# Altium schematic sheet SHC_BMS.SchDoc
size A4
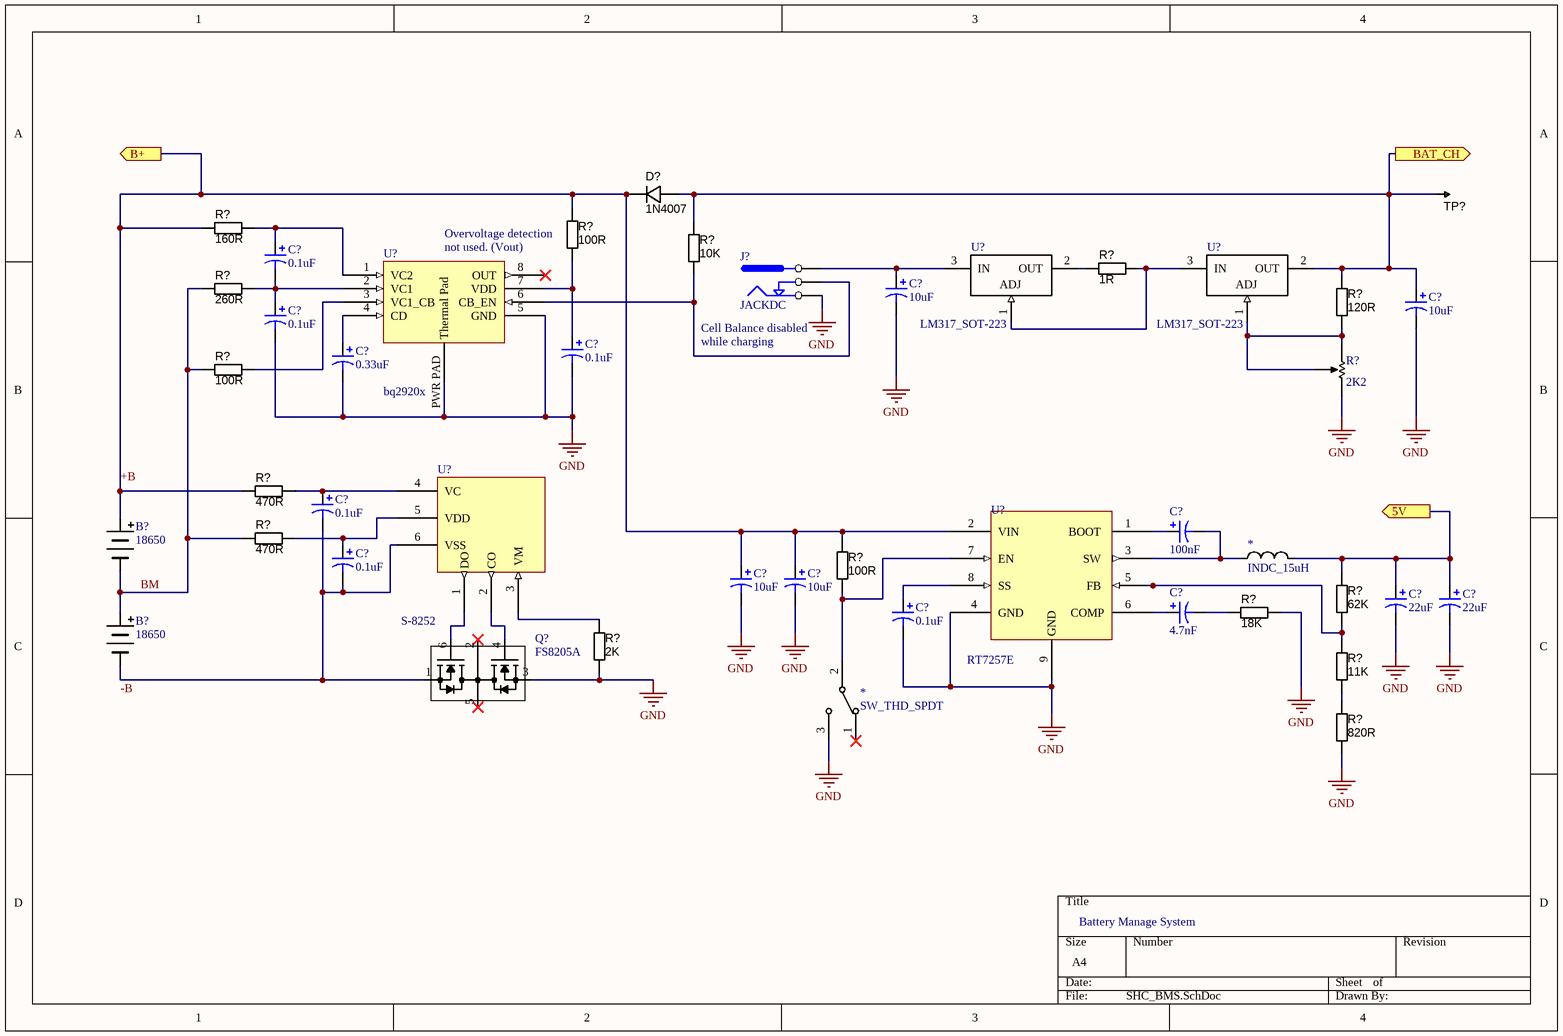
[diagram p0: SHC_BMS.SchDoc]

## Parts
(Parts that share a designator on the sheet are numbered #1, #2 ... from top to bottom, then left to right.)
*#1  INDC_15uH
*#2  SW_THD_SPDT
B?#1  18650
B?#2  18650
C?#1  value 0.1uF  [C0805]  (hidden comment: Cap Pol3)
C?#2  value 10uF  [C0805]  (hidden comment: Cap Pol3)
C?#3  value 10uF  [C0805]  (hidden comment: Cap Pol3)
C?#4  value 0.1uF  [C0805]  (hidden comment: Cap Pol3)
C?#5  value 0.1uF  [C0805]  (hidden comment: Cap Pol3)
C?#6  value 0.33uF  [C0805]  (hidden comment: Cap Pol3)
C?#7  value 0.1uF  [C0805]  (hidden comment: Cap Pol3)
C?#8  value 100nF  [C0805]  (hidden comment: Cap Pol3)
C?#9  value 0.1uF  [C0805]  (hidden comment: Cap Pol3)
C?#10  value 10uF  [C0805]  (hidden comment: Cap Pol3)
C?#11  value 10uF  [C0805]  (hidden comment: Cap Pol3)
C?#12  value 4.7nF  [C0805]  (hidden comment: Cap Pol3)
C?#13  value 22uF  [C0805]  (hidden comment: Cap Pol3)
C?#14  value 22uF  [C0805]  (hidden comment: Cap Pol3)
C?#15  value 0.1uF  [C0805]  (hidden comment: Cap Pol3)
D?  1N4007  [DO-41]
J?  JACKDC  [JACKDC]
Q?  FS8205A
R?#1  160R  [RESC3216X70N]
R?#2  100R  [RESC3216X70N]
R?#3  10K  [RESC3216X70N]
R?#4  value 1R  [RESC6332X70N]  (hidden comment: RES_1R_2512)
R?#5  260R  [RESC3216X70N]
R?#6  120R  [RESC3216X70N]
R?#7  100R  [RESC3216X70N]
R?#8  2K2
R?#9  470R  [RESC3216X70N]
R?#10  470R  [RESC3216X70N]
R?#11  100R  [RESC3216X70N]
R?#12  62K  [RESC3216X70N]
R?#13  18K  [RESC3216X70N]
R?#14  2K  [RESC3216X70N]
R?#15  11K  [RESC3216X70N]
R?#16  820R  [RESC3216X70N]
TP?  TESTPOINT  [TP-R60]  (value not drawn)  (no BOM)
U?#1  LM317_SOT-223
U?#2  LM317_SOT-223
U?#3  bq2920x
U?#4  S-8252
U?#5  RT7257E

## Ports
5V (out), B+ (out), BAT_CH (out)

## Nets
GND: *#2.3 C?#2.2 C?#3.2 C?#4.2 C?#5.2 C?#6.2 C?#10.2 C?#11.2 C?#13.2 C?#14.2 C?#15.2 J?.3 Q?.3(D2) R?#8.3(CW) R?#13.2 R?#14.2 R?#16.2 U?#3.5(GND) U?#3.PWR_PAD(Thermal_Pad) U?#5.4(GND) U?#5.9(GND)
5V: *#1.2 C?#13.1 C?#14.1 R?#12.1 ; port 5V
+B: B?#1.1 C?#10.1 C?#11.1 D?.K R?#1.1 R?#2.1 R?#9.1 R?#11.1 U?#5.2(VIN) ; port B+
-B: B?#2.2 C?#7.2 C?#9.2 Q?.1(S1) U?#4.6(VSS)
BAT_CH: C?#3.1 D?.A R?#3.1 R?#6.1 TP?.1 U?#2.2(OUT) ; port BAT_CH
BM: B?#1.2 B?#2.1 R?#5.1 R?#7.1 R?#10.1
Net*#1_1: *#1.1 C?#8.2 U?#5.3(SW)
Net*#2_2: *#2.2 R?#11.2 U?#5.7(EN)
NetC?#1_1: C?#1.1 R?#1.2 U?#3.1(VC2)
NetC?#1_2: C?#1.2 C?#4.1 R?#5.2 U?#3.2(VC1)
NetC?#2_1: C?#2.1 J?.1 U?#1.3(IN)
NetC?#5_1: C?#5.1 R?#2.2 U?#3.7(VDD)
NetC?#6_1: C?#6.1 U?#3.4(CD)
NetC?#7_1: C?#7.1 R?#9.2 U?#4.4(VC)
NetC?#8_1: C?#8.1 U?#5.1(BOOT)
NetC?#9_1: C?#9.1 R?#10.2 U?#4.5(VDD)
NetC?#12_1: C?#12.1 U?#5.6(COMP)
NetC?#12_2: C?#12.2 R?#13.1
NetC?#15_1: C?#15.1 U?#5.8(SS)
NetJ?_2: J?.2 R?#3.2 U?#3.6(CB_EN)
NetQ?_4: Q?.4(G2) U?#4.2(CO)
NetQ?_6: Q?.6(G1) U?#4.1(DO)
NetR?#4_1: R?#4.1 U?#1.2(OUT)
NetR?#4_2: R?#4.2 U?#1.1(ADJ) U?#2.3(IN)
NetR?#6_2: R?#6.2 R?#8.1(CCW) R?#8.2(WIPER) U?#2.1(ADJ)
NetR?#7_2: R?#7.2 U?#3.3(VC1_CB)
NetR?#12_2: R?#12.2 R?#15.1 U?#5.5(FB)
NetR?#14_1: R?#14.1 U?#4.3(VM)
NetR?#15_2: R?#15.2 R?#16.1

Not connected (* = marked no-connect by the designer): *#2 1*; Q? 2(D1)* 5(D2)*; U?#3 8(OUT)*

## Notes on the sheet
- (near R?#2) Overvoltage detection
- not used. (Vout)
- (near J?) Cell Balance disabled
- (near J?) while charging
- Battery Manage System

## Library data of the parts
*#1 = INDC_15uH: 15uH ±20% 4.2A 28.4mΩ SMD,12.5x12.5x6.5mm Power Inductors
*#2 = SW_THD_SPDT: Switch 2 position
B?#1 B?#2 = Battery_18650
C?#1-C?#15 = Cap Pol3: Polarized Capacitor (Surface Mount); Published: 8-Jun-2000; LatestRevisionDate: 29-May-2009; LatestRevisionNote: IPC-7351 Footprint Added.; PackageReference: C0805; Publisher: Altium Limited; PackageDescription: Chip Capacitor
D? = DIODE_1N4007_1000V_1.0A_DO-41: Diode 1N4007 1A 1000V THD; Manufacturer 1: Diodes Inc; Manufacturer Part Number 1: 1N4007-T; Ratings: 100V; 1.5A; Diode Type: Standard; Value: Vf = 1.15V @ 1.5A (Max); SCDType: spec; Package / Case: DO-41; Mounting Type: Through Hole
Q? = FS8205A: NMOS, Drain-Connected, Imax 6A
R?#1-R?#3 R?#5-R?#7 R?#9-R?#16 = RES_1206: Resistor SMD, 1206; Value: N/A
R?#4 = RES_1R_2512: Resistor SMD 1Ω ±5% 2W ±400ppm/℃ 2512; Manufacturer 1: Vishay/Dale; Manufacturer Part Number 1: CRCW25123K30JNEG; Ratings: 1W; SCDType: spec; Tolerance: ±5%; Material: Thick Film; Supplier 1: Digi-Key; Supplier Part Number 1: 541-3.3KXCT-ND; Package / Case: 2512 (6332 metric)
R?#8 = RES_Var_SMD: Resistor SMD Variable
TP? = TESTPOINT: SMD test pin
U?#1 U?#2 = LM317_SOT-223: Linear Voltage Regulator
U?#3 = bq2920x: Automatic Cell Balance 2S Li-Ion Battery
U?#4 = S-8252: Battery protection IC for 2S battery pack
U?#5 = RT7257E: DC/DC Buck Converter, 3A, 4.5V-17V Vin